# EasyEDA Pro project 串口模块.epro, board 蓝牙通用三通模块V2
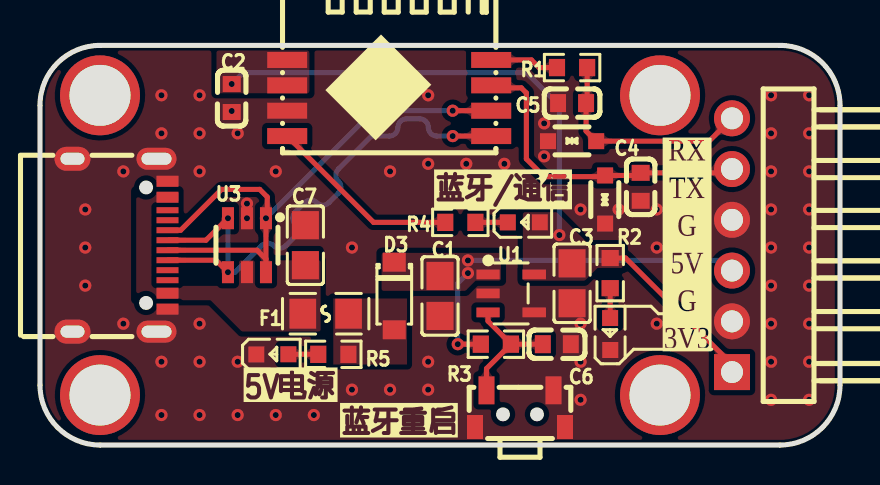
[diagram p6: board, top side]
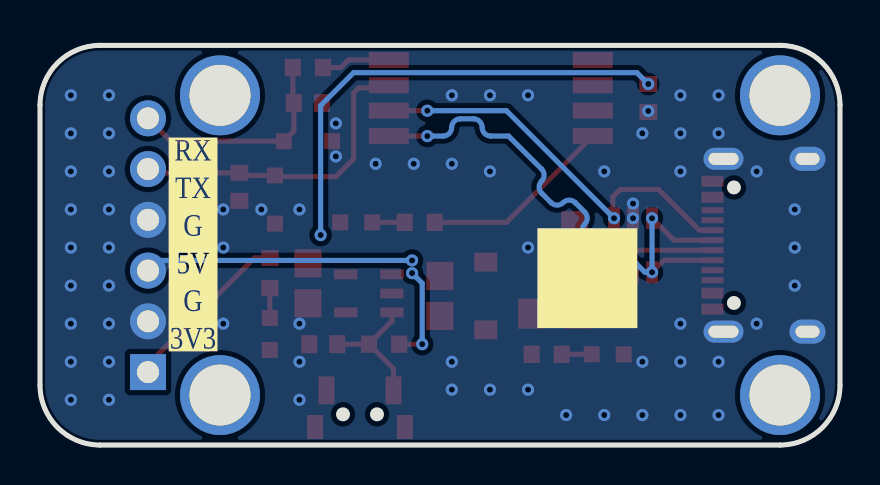
[diagram p7: board, bottom side, seen from below]

Outline 40 x 20 mm; copper layers: Top Layer, Bottom Layer. Coordinates in mm from the lower left corner of the outline.
Outline path: 0,17 0,3 arc(0.88,0.88) 3,0 37,0 arc(39.12,0.88) 40,3 40,17 arc(39.12,19.12) 37,20 3,20 arc(0.88,19.12) 0,17
Stack: Top Layer 0.035mm / Dielectric1 1.51mm FR4 er 4.5 / Bottom Layer 0.035mm

## Design rules (mm)
net D+: DP1
net D-: DP1
template: xyf1.0
spacing copperThickness1oz (default): track to track 0.102, other pairs 0.152 to 0.3
spacing copperThickness2oz: track to track 0.203, other pairs 0.152 to 0.3
spacing copperThicknessInner0.5oz: track to track 0.089, other pairs 0.152 to 0.3
track width copperThickness1oz (default): min 0.127, default 0.254, max 2.54
track width copperThickness2oz: min 0.203, default 0.254, max 2.54
track width copperThickness0.5oz: min 0.089, default 0.254, max 2.54
differential pair differentialPair (default): width min 0.127, default 0.254, max 2.54; gap min 0.152, default 0.152
via viaSize (default): diameter min 0.5, default 0.61, max 10; hole min 0.3, default 0.305, max 6.3
via viaSize2: diameter min 0.5, default 0.61, max 10; hole min 0.3, default 0.305, max 6.299
via viaSize4: diameter min 0.45, default 0.61, max 10; hole min 0.3, default 0.305, max 6.299

## Placement (name value [footprint] x y rotation side)
C1  10uF  [C0805]  20 7.46 90 top
C2  100nF  [C0603]  9.59 17.37 90 top
C3  10uF  [C0805]  26.6 8.09 90 top
C4  47pF  [C0603]  30.03 12.92 90 top
C5  47pF  [C0603]  26.6 17.11 0 top
C6  100nF  [C0603]  25.84 5.05 180 top
C7  10uF  [C0805]  13.27 10 270 top
D1  PESD5V0S1BA,115  [SOD-323_L1.7-W1.3-LS2.5-BI]  28.25 12.29 90 top
D2  PESD5V0S1BA,115  [SOD-323_L1.7-W1.3-LS2.5-BI]  26.6 15.21 0 top
D3  B5819W  [SOD-123_L2.8-W1.8-LS3.7-RD]  17.71 7.46 270 top
F1  SMD0805B050TF  [F0805]  14.28 6.57 180 top
H1  PZ254R-11-06P  [HDR-TH_6P-P2.54-H-M-W10.4]  34.6 10 90 top
LED1  XL-1608SURC-06  [LED0603-RD_RED]  28.51 5.56 90 top
LED2  NCD0603Y1  [LED0603-RD]  24.19 11.14 0 top
LED3  XL-1608SURC-06  [LED0603-RD_RED]  11.62 4.54 0 top
QR1  -  [JLC-QRCODE-5x5]  12.63 8.35 180 bottom
R1  33Ω  [R0603]  26.6 18.89 0 top
R2  10kΩ  [R0603]  28.51 8.6 90 top
R3  10kΩ  [R0603]  22.79 5.05 180 top
R4  10kΩ  [R0603]  21.02 11.14 180 top
R5  10kΩ  [R0603]  14.67 4.54 0 top
SCREW1  -  [M2螺丝]  3 17.5 0 top
SCREW2  -  [M2螺丝]  31 17.5 0 top
SCREW3  -  [M2螺丝]  3 2.5 0 top
SCREW4  -  [M2螺丝]  31 2.5 0 top
SW1  TS24CA 250gf 013  [SW-SMD_L4.7-W3.5-P3.35-EH]  24 1.82 180 top
U1  RT9013-33GB  [SOT-23-5_L3.0-W1.7-P0.95-LS2.8-BL]  23.56 7.59 270 top
U2  BLE-SER-A-ANT  [WIFI-SMD_8P-P1.27_CH9140]  17.46 17.37 0 top
U3  USBLC6-2SC6-ES  [SOT-23-6_L2.9-W1.6-P0.95-LS2.8-BR]  10.35 10 90 top
USB1  TYPE-C 16PIN 2MD(073)  [USB-C-SMD_TYPE-C-6PIN-2MD-073]  4 10 270 top

## Footprints (pads in the part's own frame, mm; a bottom-side part is the same pattern mirrored in y, then rotated)
C0603
  rect 0.8x0.9 smd: 1(-0.7,0) 2(0.7,0)
C0805
  rect 1.41x1.35 smd: 1(-1,0) 2(1,0)
F0805
  rect 1.335x1.5 smd: 1(-1.143,0) 2(1.143,0)
HDR-TH_6P-P2.54-H-M-W10.4
  rect 1.8x1.8 hole 1.1: 1(-6.35,0)
  round 1.8 hole 1.1: 2(-3.81,0) 3(-1.27,0) 4(1.27,0) 5(3.81,0) 6(6.35,0)
LED0603-RD
  rect 0.8x0.8 smd: 1(-0.799,0) 2(0.799,0)
LED0603-RD_RED
  rect 0.8x0.8 smd: 1(-0.799,-0.004) 2(0.799,0.004)
M2螺丝
  round 4 hole 3.05x2.02: 1(0,0)
R0603
  rect 0.806x0.864 smd: 1(-0.753,0) 2(0.753,0)
SOD-123_L2.8-W1.8-LS3.7-RD
  rect 0.95x1.15 smd: 1(-1.692,0) 2(1.692,0)
SOD-323_L1.7-W1.3-LS2.5-BI
  rect 0.8x0.8 smd: 1(-1.205,0) 2(1.205,0)
SOT-23-5_L3.0-W1.7-P0.95-LS2.8-BL
  rect 0.49x1.157 smd: 1(-0.95,-1.153) 2(0,-1.153) 3(0.95,-1.153)
  rect 0.49x1.175 smd: 4(0.95,1.153) 5(-0.95,1.153)
SOT-23-6_L2.9-W1.6-P0.95-LS2.8-BR
  rect 1.1x0.6 smd: 1(1.35,-0.95) 2(1.35,0) 3(1.35,0.95) 4(-1.35,0.95) 5(-1.35,0) 6(-1.35,-0.95)
SW-SMD_L4.7-W3.5-P3.35-EH
  rect 0.8x1.4 smd: 1(-1.675,-0.917) 2(1.675,-0.917)
  rect 0.8x1.2 smd: 3(-2.25,0.917) 4(2.25,0.917)
USB-C-SMD_TYPE-C-6PIN-2MD-073
  rect 0.55x1.1 smd: 1(-3.2,2.375) 2(-2.4,2.375) 11(2.4,2.375) 12(3.2,2.375)
  rect 0.3x1.1 smd: 3(-1.75,2.375) 4(-1.25,2.375) 5(-0.75,2.375) 6(-0.25,2.375) 7(0.25,2.375) 8(0.75,2.375) 9(1.25,2.375) 10(1.75,2.375)
  oval 1.1x2 hole 0.6x1.5: 13(-4.325,1.825) 14(4.325,1.825)
  oval 1.2x1.8 hole 0.6x1.2: 13(-4.325,-2.375) 14(4.325,-2.375)
WIFI-SMD_8P-P1.27_CH9140
  rect 2x0.8 smd: 1(-5.1,1.905) 2(-5.1,0.635) 3(-5.1,-0.635) 4(-5.1,-1.905) 5(5.1,-1.905) 6(5.1,-0.635) 7(5.1,0.635) 8(5.1,1.905)

## Nets
As in the schematic.

Pads without a net: SCREW1 1; SCREW2 1; SCREW3 1; SCREW4 1; USB1 3 4 9 10

## Via types
v1: diameter 0.61, hole 0.305, Top Layer to Bottom Layer, 74 vias

## Routing (per net, layer and track width the routed paths; a pad name or vN(x,y) marks a point on that pad's centre or on a via; arc(x,y) is an arc through that point)
3V3: length 32.5
  Top Layer w0.254: H1.1 34.6,4.04 29.28,9.36 R2.2
  Bottom Layer w0.254: v1(9.59,18.07) 10.16,18.64 24.32,18.64 25.97,16.98 v1(25.97,10.51)
+5V: length 18.3
  Top Layer w0.254: R3.2 v1(20.89,5.05)
  Bottom Layer w0.254: v1(21.4,9.24) 34.09,9.24 H1.3 ; v1(20.89,5.05) 20.89,8.09 v1(21.4,8.6)
GND:
  vias: v1(2.26,11.79) v1(2.26,9.88) v1(2.26,7.98) v1(4.17,13.69) v1(4.17,6.07) v1(6.07,17.5) v1(6.07,15.6) v1(6.07,4.17) v1(6.07,1.5) v1(7.98,17.5) v1(7.98,15.6) v1(7.98,13.69) v1(7.98,6.07) v1(7.98,4.17) v1(7.98,1.5) v1(9.59,16.72) v1(9.88,15.6) v1(9.88,4.17) v1(9.88,1.5) v1(10.35,12.08) v1(10.35,11.35) v1(11.79,13.69) v1(11.79,1.5) v1(13.69,1.5) v1(15.6,17.5) v1(15.6,9.88) v1(15.6,2.77) v1(17.5,17.5) v1(17.5,13.69) v1(17.5,2.77) v1(19.41,17.5) v1(19.41,14.07) v1(19.41,4.17) v1(19.41,2.77) v1(21.31,14.07) v1(23.22,14.07) v1(25.21,16.1) v1(25.21,14.44) v1(27.03,11.79) v1(27.03,6.07) v1(27.03,4.17) v1(27.03,2.26) v1(28.93,11.79) v1(30.84,11.79) v1(30.84,9.88) v1(30.84,6.07) v1(36.55,17.5) v1(36.55,15.6) v1(36.55,13.69) v1(36.55,11.79) v1(36.55,9.88) v1(36.55,7.98) v1(36.55,6.07) v1(36.55,4.17) v1(36.55,2.26) v1(38.46,17.5) v1(38.46,15.6) v1(38.46,13.69) v1(38.46,11.79) v1(38.46,9.88) v1(38.46,7.98) v1(38.46,6.07) v1(38.46,4.17) v1(38.46,2.26)
D+: length 28.4
  Top Layer w0.254: v1(9.4,8.65) 8.8,9.25 USB1.8 ; USB1.6 8.3,10.25 v1(9.4,11.35) ; U2.5 v1(20.63,15.46)
  Bottom Layer w0.254: v1(9.4,11.35) v1(9.4,8.65) 9.76,8.65 11.08,9.98 arc(11.38,10.1) 11.69,9.98 arc(11.99,9.85) 12.29,9.98 12.76,10.45 arc(12.89,10.75) 12.76,11.05 arc(12.64,11.36) 12.76,11.66 13.24,12.13 arc(13.54,12.26) 13.84,12.13 arc(14.14,12.01) 14.45,12.13 14.92,12.6 arc(15.04,12.91) 14.92,13.21 arc(14.79,13.51) 14.92,13.81 16.57,15.46 17.46,15.46 arc(17.77,15.59) 17.89,15.89 arc(18.02,16.2) 18.33,16.33 18.99,16.33 arc(19.29,16.2) 19.42,15.89 arc(19.54,15.59) 19.85,15.46 v1(20.63,15.46)
D-: length 28.4
  Top Layer w0.254: U2.6 v1(20.63,16.73) ; USB1.7 10.85,9.75 11.3,9.3 ; 11.3,9.3 U3.6 ; 11.3,9.3 v1(11.3,11.35) 11.36,11.42 11.36,12.41 10.98,12.79 9.08,12.79 7.03,10.75 USB1.5
  Bottom Layer w0.254: v1(11.3,11.35) 16.68,16.73 v1(20.63,16.73)
RX: length 11.2
  Top Layer w0.254: R1.2 27.36,17.17 C5.2 27.3,15.71 27.81,15.21 33.46,15.21 H1.6
TX: length 16
  Top Layer w0.254: U2.7 22.69,17.87 24.06,17.87 24.32,17.62 24.32,14.32 25.21,13.43 28.19,13.43 D1.2 29.9,13.49 30.03,13.62 34.41,13.62 H1.5
$1N600: length 9.7
  Top Layer w0.254: U2.4 16.68,11.14 R4.2
$1N1806: length 1.5
  Top Layer w0.254: LED3.2 13.91,4.54 R5.1
$1N3334: length 1.5
  Top Layer w0.254: LED1.2 28.51,6.36 R2.1
$1N4390: length 1.6
  Top Layer w0.254: R4.1 LED2.1
$1N7016: length 3.4
  Top Layer w0.254: U2.8 24.57,19.27 24.95,18.89 R1.1
$1N7023: length 6.5
  Top Layer w0.254: R3.1 22.32,3.82 SW1.2 ; R3.1 C6.2 ; R3.1 23.55,5.06 22.4,6.2 U1.3

## Copper pours and planes (outline as drawn; the poured copper is in the pictures)
3V3 on Top Layer: 24.14,11.65 24.14,8.22 27.24,8.22 27.87,8.86 29.14,8.86 29.14,9.87 29.02,10 27.49,10 25.84,11.65
3V3 on Top Layer: 8.82,20.41 13.47,20.41 13.47,17.6 8.82,17.6
+5V on Top Layer: 17.08,9.62 17.08,7.71 21.27,7.71 21.78,8.22 23.05,8.22 23.05,9.62
GND on Top Layer: -0.83,21.56 41.08,21.56 41.08,-2.57 -0.83,-2.57
GND on Bottom Layer: -0.83,21.56 41.08,21.56 41.08,-2.57 -0.83,-2.57
$1N3665 on Top Layer: 5.78,7.97 9.71,7.97 9.84,8.09 9.84,9.24 14.03,9.24 14.03,5.68 10.09,5.68 8.53,7.24 5.78,7.24
$1N3665 on Top Layer: 4.81,12.7 6.93,12.7 6.93,7.3 4.81,7.3
$1N7589 on Top Layer: 14.67,7.33 18.35,7.33 18.35,4.03 14.67,4.03

Small or netless copper shapes (teardrops, artwork), in the pictures only: 50 on Top Layer, 12 on Bottom Layer

## Text on the board
Bottom Silkscreen Layer: RX / TX / G / 5V / G / 3V3
Top Silkscreen Layer: RX / TX / G / 5V / G / 3V3 | 5V电源 | 蓝牙重启 | 蓝牙/通信
